# Altium schematic sheet Sheet3.SchDoc
size A4; SheetNumber: 1; SheetTotal: 2
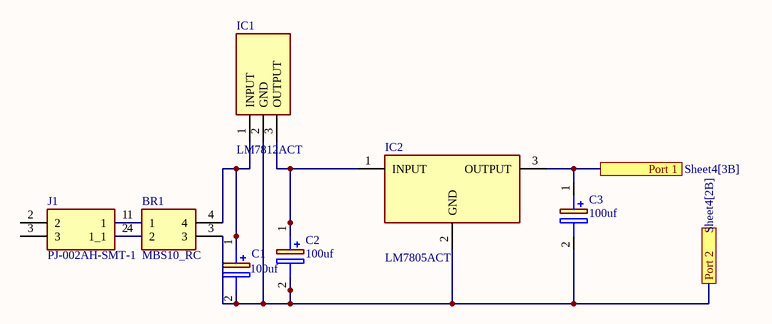
[diagram p0: Sheet3.SchDoc]

## Parts
BR1  MBS10_RC  [SOP240P690X290-4N]
C1  100uf  [CAPPRD500W65D1250H2700]
C2  100uf  [CAPPRD500W65D1250H2700]
C3  100uf  [CAPPRD500W65D1250H2700]
IC1  LM7812ACT  [TO254P470X1016X2019-3P]
IC2  LM7805ACT  [TO254P470X1016X2019-3P]
J1  PJ-002AH-SMT-1  [PJ002AHSMT1]

## Ports
Port 1 (see Sheet4[3B]), Port 2 (see Sheet4[2B])

## Nets
Port 1: C3.1(+) IC2.3(OUTPUT) ; port Port 1
Port 2: BR1.3 C1.2(-) C2.2(-) C3.2(-) IC1.2(GND) IC2.2(GND) ; port Port 2
NetBR1_1: BR1.1 J1.1
NetBR1_2: BR1.2 J1.4(1_1)
NetBR1_4: BR1.4 C1.1(+) IC1.1(INPUT)
NetC2_1: C2.1(+) IC1.3(OUTPUT) IC2.1(INPUT)

Not connected (* = marked no-connect by the designer): J1 2 3

## Library data of the parts
BR1 = MBS10_RC: Bridge Rectifier; Manufacturer_Name: Taiwan Semiconductor; Manufacturer_Part_Number: MBS10 RC; Height: 2.9mm; Mouser Part Number: N/A; Mouser Price/Stock: https://www.mouser.com/Search/Refine.aspx?Keyword=N%2FA; Arrow Part Number: MBS10 RC; Arrow Price/Stock: https://www.arrow.com/en/products/mbs10rc/taiwan-semiconductor?region=nac
C1-C3 = EEUTA1E102LB: Capacitor Polarised; Manufacturer_Name: Panasonic; Datasheet Link: http://industrial.panasonic.com/cdbs/www-data/pdf/RDF0000/ABA0000C1212.pdf; Height: 27mm; Manufacturer_Part_Number: EEUTA1E102LB
IC1 = LM7812ACT: Integrated Circuit; Manufacturer_Name: onsemi; Datasheet Link: https://datasheet.datasheetarchive.com/originals/distributors/Datasheets_SAMA/704b005d7d2d9ced5864f40b6609c1bc.pdf; Height: 4.7mm; Manufacturer_Part_Number: LM7812ACT; Mouser Part Number: 512-LM7812ACT; Mouser Price/Stock: https://www.mouser.com/Search/Refine.aspx?Keyword=512-LM7812ACT; Arrow Part Number: LM7812ACT; Arrow Price/Stock: https://www.arrow.com/en/products/lm7812act/on-semiconductor
IC2 = LM7805ACT: Integrated Circuit; Manufacturer_Name: onsemi; Datasheet Link: https://componentsearchengine.com/Datasheets/2/LM7805ACT.pdf; Height: 4.7mm; Manufacturer_Part_Number: LM7805ACT; Mouser Part Number: 512-LM7805ACT; Mouser Price/Stock: https://www.mouser.co.uk/ProductDetail/ON-Semiconductor-Fairchild/LM7805ACT?qs=VOMQJJE%252BBNlQknJDd4ZVLg%3D%3D; Arrow Part Number: LM7805ACT; Arrow Price/Stock: https://www.arrow.com/en/products/lm7805act/on-semiconductor
J1 = PJ-002AH-SMT-1: Connector; Manufacturer_Name: CUI Devices; Datasheet Link: https://www.cui.com/product/resource/pj-002ah-smt-tr.pdf; Height: 11mm; Manufacturer_Part_Number: PJ-002AH-SMT-1; Mouser Part Number: N/A; Mouser Price/Stock: https://www.mouser.co.uk/ProductDetail/CUI-Inc/PJ-002AH-SMT-1/?qs=WyjlAZoYn53v8l9vpJCO1Q%3D%3D